# Altium schematic sheet Sheet1.SchDoc
size A3; SheetNumber: 1; SheetTotal: 1; Project: IGBT Gate Driver 15A
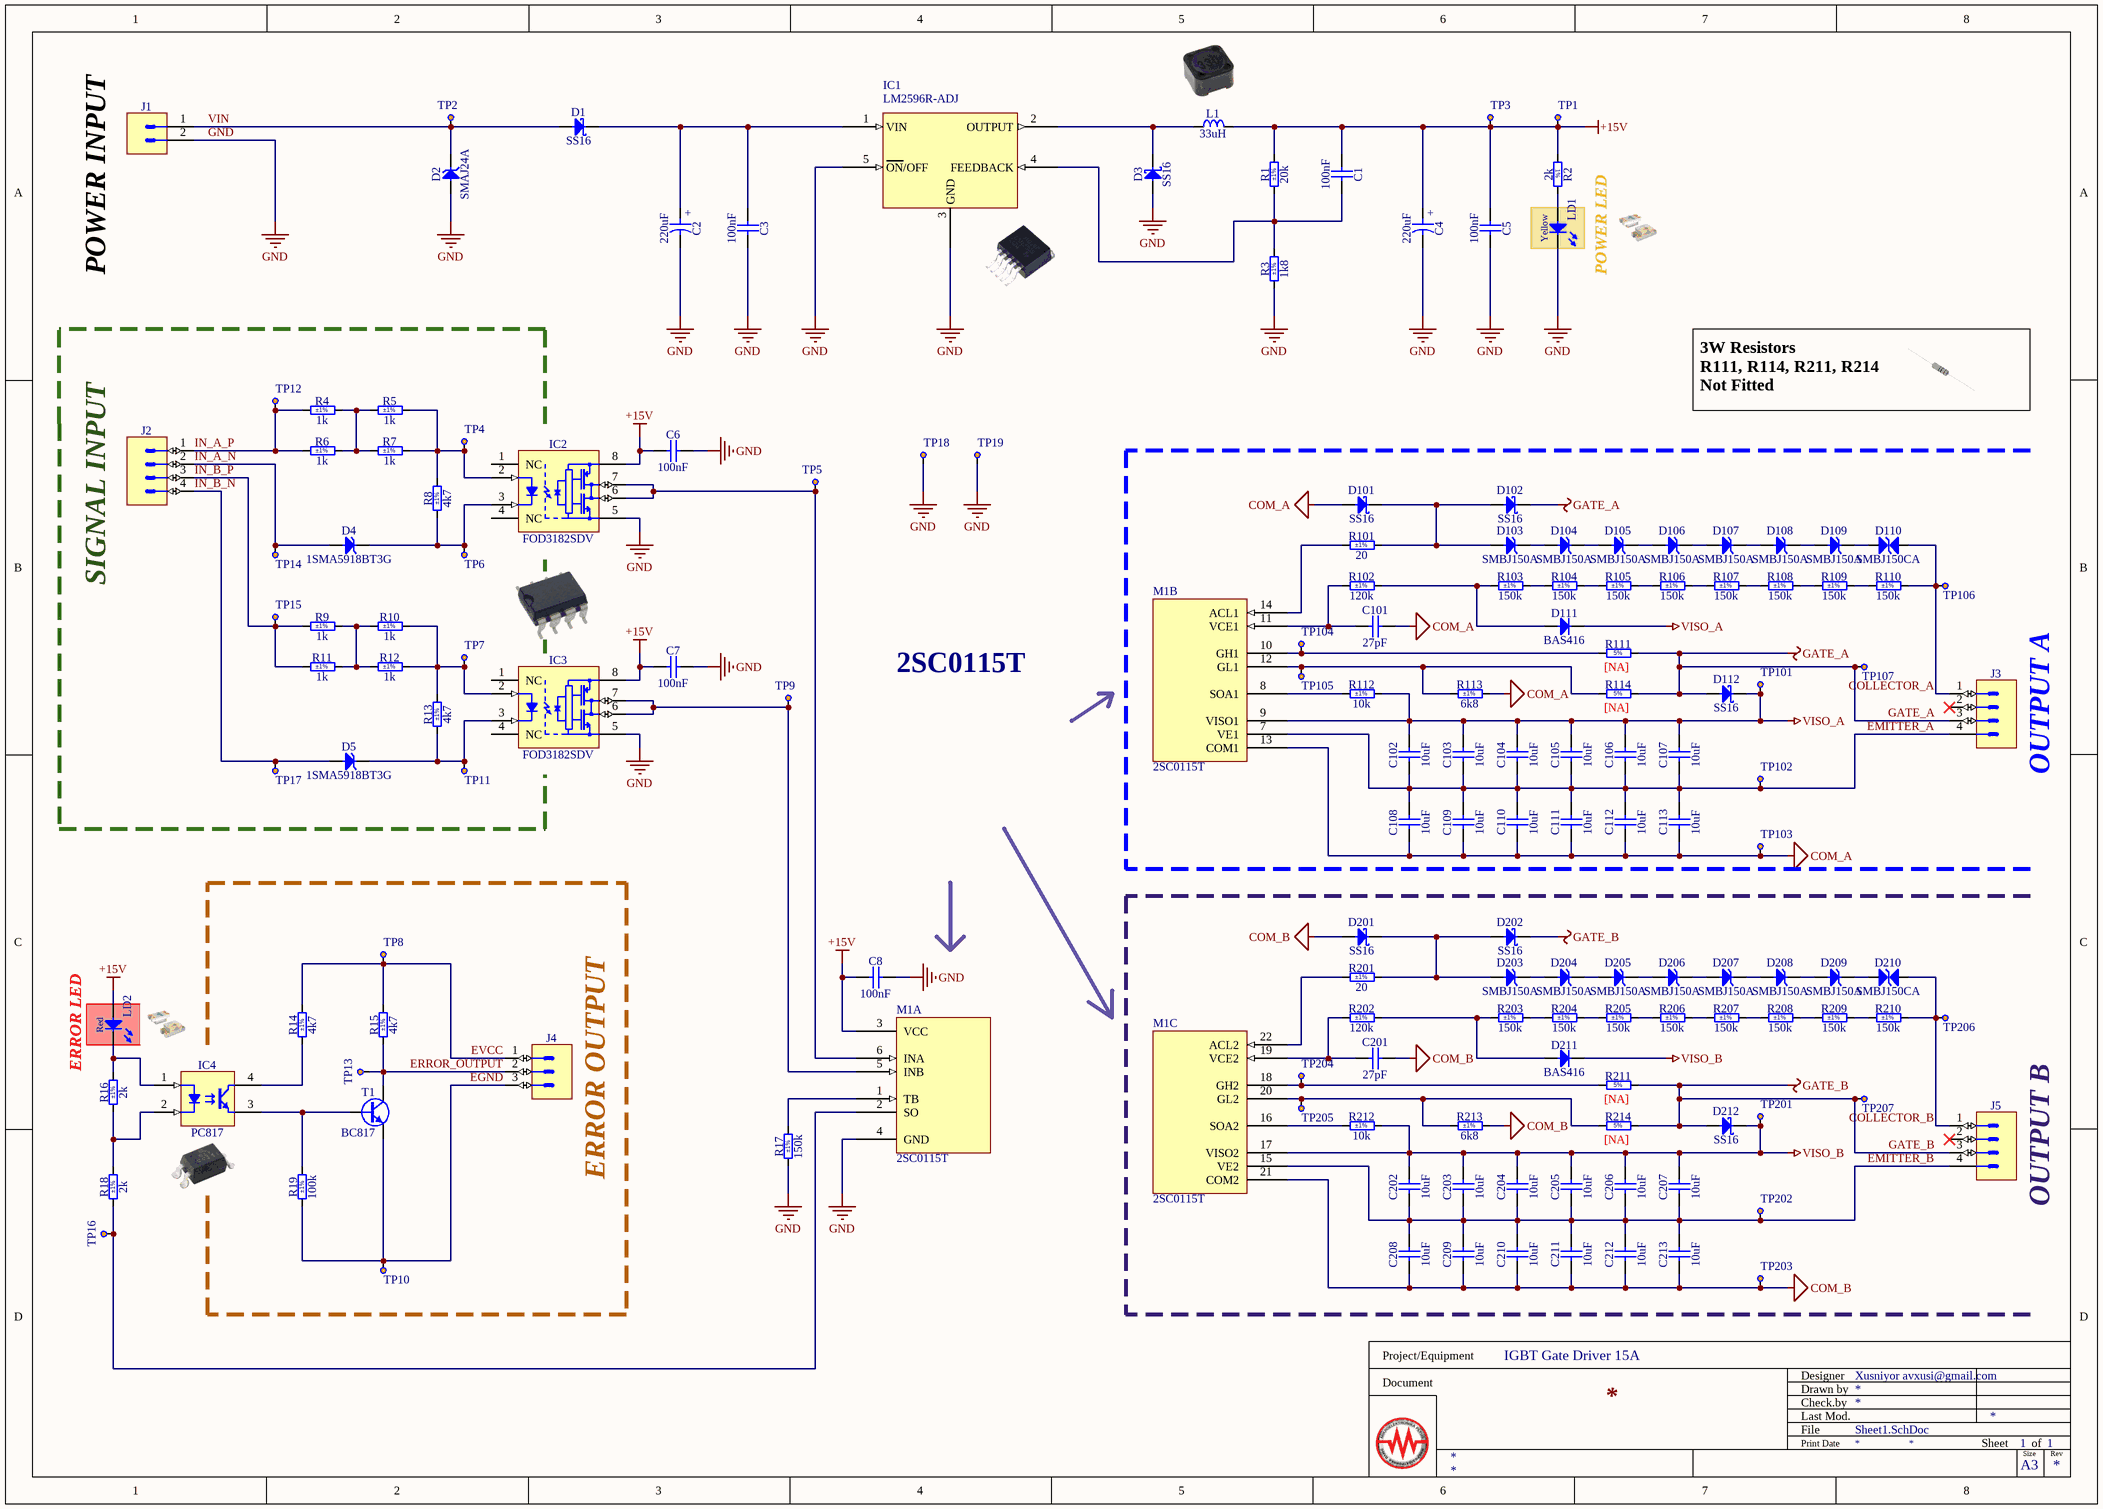
[diagram p0: Sheet1.SchDoc]

## Parts
C1  100nF  [CAPC3216X140N]
C2  220uF  [CAPPR500-1050X1750]
C3  100nF  [CAPC3216X140N]
C4  220uF  [CAPPR500-1050X1750]
C5  100nF  [CAPC3216X140N]
C6  100nF  [CAPC3216X140N]
C7  100nF  [CAPC3216X140N]
C8  100nF  [CAPC3216X140N]
C101  27pF  [CAPC3216X140N]
C102  10uF  [CAPC3216X180N]
C103  10uF  [CAPC3216X180N]
C104  10uF  [CAPC3216X180N]
C105  10uF  [CAPC3216X180N]
C106  10uF  [CAPC3216X180N]
C107  10uF  [CAPC3216X180N]
C108  10uF  [CAPC3216X180N]
C109  10uF  [CAPC3216X180N]
C110  10uF  [CAPC3216X180N]
C111  10uF  [CAPC3216X180N]
C112  10uF  [CAPC3216X180N]
C113  10uF  [CAPC3216X180N]
C201  27pF  [CAPC3216X140N]
C202  10uF  [CAPC3216X180N]
C203  10uF  [CAPC3216X180N]
C204  10uF  [CAPC3216X180N]
C205  10uF  [CAPC3216X180N]
C206  10uF  [CAPC3216X180N]
C207  10uF  [CAPC3216X180N]
C208  10uF  [CAPC3216X180N]
C209  10uF  [CAPC3216X180N]
C210  10uF  [CAPC3216X180N]
C211  10uF  [CAPC3216X180N]
C212  10uF  [CAPC3216X180N]
C213  10uF  [CAPC3216X180N]
D1  SS16  [DIOM5127X229N]
D2  SMAJ24A  [DIOM5226X262N]
D3  SS16  [DIOM5127X229N]
D4  1SMA5918BT3G  [DIOM5226X220N]
D5  1SMA5918BT3G  [DIOM5226X220N]
D101  SS16  [DIOM5127X229N]
D102  SS16  [DIOM5127X229N]
D103  SMBJ150A  [DIOM5336X265N]
D104  SMBJ150A  [DIOM5336X265N]
D105  SMBJ150A  [DIOM5336X265N]
D106  SMBJ150A  [DIOM5336X265N]
D107  SMBJ150A  [DIOM5336X265N]
D108  SMBJ150A  [DIOM5336X265N]
D109  SMBJ150A  [DIOM5336X265N]
D110  SMBJ150CA  [DIOM5336X265N]
D111  BAS416  [SOD2512X110N]
D112  SS16  [DIOM5127X229N]
D201  SS16  [DIOM5127X229N]
D202  SS16  [DIOM5127X229N]
D203  SMBJ150A  [DIOM5336X265N]
D204  SMBJ150A  [DIOM5336X265N]
D205  SMBJ150A  [DIOM5336X265N]
D206  SMBJ150A  [DIOM5336X265N]
D207  SMBJ150A  [DIOM5336X265N]
D208  SMBJ150A  [DIOM5336X265N]
D209  SMBJ150A  [DIOM5336X265N]
D210  SMBJ150CA  [DIOM5336X265N]
D211  BAS416  [SOD2512X110N]
D212  SS16  [DIOM5127X229N]
IC1  LM2596R-ADJ  [TO-263-5]
IC2  FOD3182SDV  [FAIRCHILD_8LD MDIP (OPTION S)]
IC3  FOD3182SDV  [FAIRCHILD_8LD MDIP (OPTION S)]
IC4  PC817  [FAIRCHILD_FOD817DSD]
J1  (no value)  [PHOENIX_1777073]
J2  (no value)  [PHOENIX_1777099]
J3  (no value)  [PHOENIX_1777099]
J4  (no value)  [PHOENIX_1777086]
J5  (no value)  [PHOENIX_1777099]
L1  33uH  [IND_BOURNS_PM127SH]
LD1  Yellow  [LED_3MM_YELLOW_1C-2A]
LD2  Red  [LED_3MM_RED_1C-2A]
M1  2SC0115T  [2sc0115t]  (parts A,B,C of 3)
R1  20k  Tolerance: ±1%  [RESC3216X65N]
R2  2k  [RESC3216X65N]
R3  1k8  Tolerance: ±1%  [RESC3216X65N]
R4  1k  Tolerance: ±1%  [RESC3216X65N]
R5  1k  Tolerance: ±1%  [RESC3216X65N]
R6  1k  Tolerance: ±1%  [RESC3216X65N]
R7  1k  Tolerance: ±1%  [RESC3216X65N]
R8  4k7  Tolerance: ±1%  [RESC3216X65N]
R9  1k  Tolerance: ±1%  [RESC3216X65N]
R10  1k  Tolerance: ±1%  [RESC3216X65N]
R11  1k  Tolerance: ±1%  [RESC3216X65N]
R12  1k  Tolerance: ±1%  [RESC3216X65N]
R13  4k7  Tolerance: ±1%  [RESC3216X65N]
R14  4k7  Tolerance: ±1%  [RESC3216X65N]
R15  4k7  Tolerance: ±1%  [RESC3216X65N]
R16  2k  Tolerance: ±1%  [RESC3216X70N]
R17  150k  Tolerance: ±1%  [RESC3216X65N]
R18  2k  Tolerance: ±1%  [RESC3216X70N]
R19  100k  Tolerance: ±1%  [RESC3216X65N]
R101  20  Tolerance: ±1%  [RESC3216X65N]
R102  120k  Tolerance: ±1%  [RESC3216X65N]
R103  150k  Tolerance: ±1%  [RESC3216X65N]
R104  150k  Tolerance: ±1%  [RESC3216X65N]
R105  150k  Tolerance: ±1%  [RESC3216X65N]
R106  150k  Tolerance: ±1%  [RESC3216X65N]
R107  150k  Tolerance: ±1%  [RESC3216X65N]
R108  150k  Tolerance: ±1%  [RESC3216X65N]
R109  150k  Tolerance: ±1%  [RESC3216X65N]
R110  150k  Tolerance: ±1%  [RESC3216X65N]
R111  5R6  [RES2286-1670X520]  (value not drawn)
R112  10k  Tolerance: ±1%  [RESC3216X65N]
R113  6k8  Tolerance: ±1%  [RESC3216X65N]
R114  5R6  [RES2286-1670X520]  (value not drawn)
R201  20  Tolerance: ±1%  [RESC3216X65N]
R202  120k  Tolerance: ±1%  [RESC3216X65N]
R203  150k  Tolerance: ±1%  [RESC3216X65N]
R204  150k  Tolerance: ±1%  [RESC3216X65N]
R205  150k  Tolerance: ±1%  [RESC3216X65N]
R206  150k  Tolerance: ±1%  [RESC3216X65N]
R207  150k  Tolerance: ±1%  [RESC3216X65N]
R208  150k  Tolerance: ±1%  [RESC3216X65N]
R209  150k  Tolerance: ±1%  [RESC3216X65N]
R210  150k  Tolerance: ±1%  [RESC3216X65N]
R211  5R6  [RES2286-1670X520]  (value not drawn)
R212  10k  Tolerance: ±1%  [RESC3216X65N]
R213  6k8  Tolerance: ±1%  [RESC3216X65N]
R214  5R6  [RES2286-1670X520]  (value not drawn)
T1  BC817  [SOT95P230X110-3N]
TP1  Test_point  [TP_C40]  (value not drawn)
TP2  Test_point  [TP_C40]  (value not drawn)
TP3  Test_point  [TP_C40]  (value not drawn)
TP4  Test_point  [TP_C40]  (value not drawn)
TP5  Test_point  [TP_C40]  (value not drawn)
TP6  Test_point  [TP_C40]  (value not drawn)
TP7  Test_point  [TP_C40]  (value not drawn)
TP8  Test_point  [TP_C40]  (value not drawn)
TP9  Test_point  [TP_C40]  (value not drawn)
TP10  Test_point  [TP_C40]  (value not drawn)
TP11  Test_point  [TP_C40]  (value not drawn)
TP12  Test_point  [TP_C40]  (value not drawn)
TP13  Test_point  [TP_C40]  (value not drawn)
TP14  Test_point  [TP_C40]  (value not drawn)
TP15  Test_point  [TP_C40]  (value not drawn)
TP16  Test_point  [TP_C40]  (value not drawn)
TP17  Test_point  [TP_C40]  (value not drawn)
TP18  Test_point  [TP_C40]  (value not drawn)
TP19  Test_point  [TP_C40]  (value not drawn)
TP101  Test_point  [TP_C40]  (value not drawn)
TP102  Test_point  [TP_C40]  (value not drawn)
TP103  Test_point  [TP_C40]  (value not drawn)
TP104  Test_point  [TP_C40]  (value not drawn)
TP105  Test_point  [TP_C40]  (value not drawn)
TP106  Test_point  [TP_C40]  (value not drawn)
TP107  Test_point  [TP_C40]  (value not drawn)
TP201  Test_point  [TP_C40]  (value not drawn)
TP202  Test_point  [TP_C40]  (value not drawn)
TP203  Test_point  [TP_C40]  (value not drawn)
TP204  Test_point  [TP_C40]  (value not drawn)
TP205  Test_point  [TP_C40]  (value not drawn)
TP206  Test_point  [TP_C40]  (value not drawn)
TP207  Test_point  [TP_C40]  (value not drawn)

## Nets
+15V: C1.1 C4.1 C5.1 C6.1 C7.1 C8.1 IC2.8(VDD) IC3.8(VDD) L1.2 LD2.2(A) M1.3(VCC) R1.2 R2.1 TP1.1 TP3.1
COM_A: C101.2 C108.1 C109.1 C110.1 C111.1 C112.1 C113.1 D101.2(A) M1.13(COM1) R113.2 TP103.1
COM_B: C201.2 C208.1 C209.1 C210.1 C211.1 C212.1 C213.1 D201.2(A) M1.21(COM2) R213.2 TP203.1
GATE_A: D102.1(C) D112.2(A) J3.3 R111.2 R114.2 TP107.1
GATE_B: D202.1(C) D212.2(A) J5.3 R211.2 R214.2 TP207.1
GND: C2.2 C3.2 C4.2 C5.2 C6.2 C7.2 C8.2 D2.2(A) D3.2(A) IC1.3(GND) IC1.5(ON/OFF) IC2.5(VSS) IC3.5(VSS) J1.2 LD1.1(C) M1.4(GND) R3.1 R17.1 TP18.1 TP19.1
VISO_A: C102.2 C103.2 C104.2 C105.2 C106.2 C107.2 D111.1(C) D112.1(C) M1.9(VISO1) R112.2 TP101.1
VISO_B: C202.2 C203.2 C204.2 C205.2 C206.2 C207.2 D211.1(C) D212.1(C) M1.17(VISO2) R212.2 TP201.1
COLLECTOR_A: D110.2 J3.1 R110.2 TP106.1
COLLECTOR_B: D210.2 J5.1 R210.2 TP206.1
EGND: J4.3 R19.1 T1.2(E) TP10.1
EMITTER_A: C102.1 C103.1 C104.1 C105.1 C106.1 C107.1 C108.2 C109.2 C110.2 C111.2 C112.2 C113.2 J3.4 M1.7(VE1) TP102.1
EMITTER_B: C202.1 C203.1 C204.1 C205.1 C206.1 C207.1 C208.2 C209.2 C210.2 C211.2 C212.2 C213.2 J5.4 M1.15(VE2) TP202.1
ERROR_OUTPUT: J4.2 R15.1 T1.3(C) TP13.1
EVCC: J4.1 R14.2 R15.2 TP8.1
IN_A_N: D4.2(A) J2.2 TP14.1
IN_A_P: J2.1 R4.1 R6.1 TP12.1
IN_B_N: D5.2(A) J2.4 TP17.1
IN_B_P: J2.3 R9.1 R11.1 TP15.1
VIN: D1.2(A) D2.1(C) J1.1 TP2.1
NetC1_2: C1.2 IC1.4(FEEDBACK) R1.1 R3.2
NetC2_1: C2.1 C3.1 D1.1(C) IC1.1(VIN)
NetC101_1: C101.1 M1.11(VCE1) R102.1
NetC201_1: C201.1 M1.19(VCE2) R202.1
NetD3_1: D3.1(C) IC1.2(OUTPUT) L1.1
NetD4_1: D4.1(C) IC2.3(K) R8.1 TP6.1
NetD5_1: D5.1(C) IC3.3(K) R13.1 TP11.1
NetD101_1: D101.1(C) D102.2(A) D103.2(A) R101.2
NetD103_1: D103.1(C) D104.2(A)
NetD104_1: D104.1(C) D105.2(A)
NetD105_1: D105.1(C) D106.2(A)
NetD106_1: D106.1(C) D107.2(A)
NetD107_1: D107.1(C) D108.2(A)
NetD108_1: D108.1(C) D109.2(A)
NetD109_1: D109.1(C) D110.1
NetD111_2: D111.2(A) R102.2 R103.1
NetD201_1: D201.1(C) D202.2(A) D203.2(A) R201.2
NetD203_1: D203.1(C) D204.2(A)
NetD204_1: D204.1(C) D205.2(A)
NetD205_1: D205.1(C) D206.2(A)
NetD206_1: D206.1(C) D207.2(A)
NetD207_1: D207.1(C) D208.2(A)
NetD208_1: D208.1(C) D209.2(A)
NetD209_1: D209.1(C) D210.1
NetD211_2: D211.2(A) R202.2 R203.1
NetIC2_2: IC2.2(A) R5.2 R7.2 R8.2 TP4.1
NetIC2_6: IC2.6(VO1) IC2.7(VO2) M1.6(INA) TP5.1
NetIC3_2: IC3.2(A) R10.2 R12.2 R13.2 TP7.1
NetIC3_6: IC3.6(VO1) IC3.7(VO2) M1.5(INB) TP9.1
NetIC4_1: IC4.1(A) LD2.1(C) R16.2
NetIC4_2: IC4.2(C) R16.1 R18.2
NetIC4_3: IC4.3(E) R19.2 T1.1(B)
NetIC4_4: IC4.4(C) R14.1
NetLD1_2: LD1.2(A) R2.2
NetM1_1: M1.1(TB) R17.2
NetM1_2: M1.2(SO) R18.1 TP16.1
NetM1_8: M1.8(SOA1) R112.1
NetM1_10: M1.10(GH1) R111.1 TP104.1
NetM1_12: M1.12(GL1) R113.1 R114.1 TP105.1
NetM1_14: M1.14(ACL1) R101.1
NetM1_16: M1.16(SOA2) R212.1
NetM1_18: M1.18(GH2) R211.1 TP204.1
NetM1_20: M1.20(GL2) R213.1 R214.1 TP205.1
NetM1_22: M1.22(ACL2) R201.1
NetR4_2: R4.2 R5.1 R6.2 R7.1
NetR9_2: R9.2 R10.1 R11.2 R12.1
NetR103_2: R103.2 R104.1
NetR104_2: R104.2 R105.1
NetR105_2: R105.2 R106.1
NetR106_2: R106.2 R107.1
NetR107_2: R107.2 R108.1
NetR108_2: R108.2 R109.1
NetR109_2: R109.2 R110.1
NetR203_2: R203.2 R204.1
NetR204_2: R204.2 R205.1
NetR205_2: R205.2 R206.1
NetR206_2: R206.2 R207.1
NetR207_2: R207.2 R208.1
NetR208_2: R208.2 R209.1
NetR209_2: R209.2 R210.1

Not connected (* = marked no-connect by the designer): IC2 1(NC) 4(NC); IC3 1(NC) 4(NC); J3 2*; J5 2*

## Notes on the sheet
- POWER INPUT
- POWER LED
- 3W Resistors
  R111, R114, R211, R214
  Not Fitted
- SIGNAL INPUT
- 2SC0115T
- (near R111) [NA]
- (near R114) [NA]
- (near J3) OUTPUT A
- ERROR LED
- (near R211) [NA]
- (near J4) ERROR OUTPUT
- (near R214) [NA]
- (near J5) OUTPUT B
- Project/Equipment
- Document
- IGBT Gate Driver 15A
- Designer
- Drawn by
- Check.by
- Xusniyor avxusi@gmail.com
- File
- Last Mod.
- Print Date
- Sheet
- Size
- A3
- of
- Rev
- (in symbol CAER_220UF_35V_20%_500-1050X1750_LESR0R084) +
- (in symbol R1206_2K_1%_0.25W_100PPM) 1%
- (in symbol RMF_5R6_5%_3W_250PPM_2286-1670X520) 5%

## Library data of the parts
C1 C3 C5-C8 = CC1206_100NF_50V_10%_X7R: Non-polarised capacitor; Part Description: SMD Multilayer Chip Ceramic Capacitor; Manufacturer: GENERIC; Manufacturer1 Part Number: VJ1206Y104KXAAT; Voltage: 50V; TC: X7R; Tolerance: ±10%; Part Number: CC1206_100NF_50V_10%_X7R; Component Kind: Standard; Component Type: Standard; Pin Count: 2; Value: 100nF; Status: Preferred; Manufacturer Part Number: CC1206_100NF_50V_10%_X7R; Case: 1206; Mounted: Yes; Socket: No; SMD: Yes; Sense: No; Manufacturer1 Example: VISHAY VITRAMON; Manufacturer1 ComponentHeight: 1.7mm; HelpURL: \\cern.ch\dfs\Applications\Altium\Datasheets\CC1206_X7R_VISHAY_VJ.pdf; Author: CERN DEM JLC; CreateDate: 03.12.2007; LatestRevisionDate: 03.12.2007
C2 C4 = CAER_220UF_35V_20%_500-1050X1750_LESR0R084: Polarised capacitor; Part Description: Low ESR 0R084  Aluminum Electrolytic Capacitor; Manufacturer: VISHAY BCCOMPONENTS; Manufacturer Part Number: MAL213660221E3 Series 136RVI; Voltage: 35V; Tolerance: ±20%; Part Number: CAER_220UF_35V_20%_500-1050X1750_LESR0R084; Component Kind: Standard; Component Type: Standard; Pin Count: 2; Value: 220uF; Status: Preferred; Case: LS5 D10.5 x H17.5; Mounted: Yes; Socket: No; SMD: No; Sense: No; ComponentHeight: 17.5mm; HelpURL: \\cern.ch\dfs\Applications\Altium\Datasheets\CAER-LESR_VISHAY_136RVI.pdf; Author: CERN DEM JLC; CreateDate: 03.07.2008; LatestRevisionDate: 16.03.2009
C101 C201 = CC1206_27PF_50V_5%_NP0: Non-polarised capacitor; Part Description: SMD Multilayer Chip Ceramic Capacitor; Manufacturer: GENERIC; Manufacturer1 Part Number: VJ1206A270JXAAT; Voltage: 50V; TC: C0G/NP0; Tolerance: ±5%; Part Number: CC1206_27PF_50V_5%_NP0; Component Kind: Standard; Component Type: Standard; Pin Count: 2; Value: 27pF; Status: Preferred; Manufacturer Part Number: CC1206_27PF_50V_5%_NP0; Case: 1206; Mounted: Yes; Socket: No; SMD: Yes; Sense: No; Manufacturer1 Example: VISHAY VITRAMON; Manufacturer1 ComponentHeight: 1.7mm; HelpURL: \\cern.ch\dfs\Applications\Altium\Datasheets\CC1206_NP0_VISHAY_VJ.pdf; Author: CERN DEM JLC; CreateDate: 03.12.2007; LatestRevisionDate: 03.12.2007
C102-C113 C202-C213 = CC1206_10UF_25V_10%_X7R: Non-polarised capacitor; Part Description: SMD Multilayer Chip Ceramic Capacitor; Manufacturer: GENERIC; Manufacturer1 Part Number: C1206C106K4RACTU; Voltage: 25V; TC: X7R; Tolerance: ±10%; Part Number: CC1206_10UF_25V_10%_X7R; Component Kind: Standard; Component Type: Standard; Pin Count: 2; Value: 10uF; Status: Preferred; Manufacturer Part Number: CC1206_10UF_25V_10%_X7R; Case: 1206; Mounted: Yes; Socket: No; SMD: Yes; Sense: No; Manufacturer1 Example: KEMET; Manufacturer1 ComponentHeight: 1.8mm; HelpURL: \\cern.ch\dfs\Applications\Altium\Datasheets\CC1206_X7R_KEMET.pdf; Author: CERN DEM JLC; CreateDate: 12.09.2012; LatestRevisionDate: 12.09.2012
D1 D3 D101 D102 D112 D201 D202 D212 = SS16: Schottky Diode; Part Description: Surface Mount Schottky Barrier Rectifier; Manufacturer: VISHAY GENERAL SEMICONDUCTOR; Voltage: 60V; Power: 1A; PressFit: No; Bonding: No; Part Number: SS16; Component Kind: Standard; Component Type: Standard; Device: SS16; PackageDescription: DO-214-AC Molded Diode, Body 5.1x2.7mm, IPC Medium Density; Manufacturer Part Number: SS16; Pin Count: 2; Case: DO-214AC; Mounted: Yes; Socket: No; SMD: Yes; Sense: No; ComponentHeight: 2.29mm; HelpURL: \\cern.ch\dfs\Applications\Altium\Datasheets\SS16.pdf; Author: CERN DEM JLC; CreateDate: 15.07.2008; LatestRevisionDate: 23.08.2010
D2 = SMAJ24A: Transient Voltage Suppressor Diode (Uni-Directional); Part Description: Surface Mount Uni-directional Transient Voltage Suppressor Diode; Manufacturer: BOURNS; Voltage: 24V; Power: 400W; PressFit: No; Bonding: No; Part Number: SMAJ24A; Component Kind: Standard; Component Type: Standard; Device: SMAJ24A; PackageDescription: DO-214-AC/SMA Diode, Molded Body; 5.21mm L X 2.605mm W X 2.62mm H, IPC Medium Density; Manufacturer Part Number: SMAJ24A; Pin Count: 2; Case: DO-214AC; Mounted: Yes; Socket: No; SMD: Yes; Sense: No; ComponentHeight: 2.62mm; HelpURL: \\cern.ch\dfs\Applications\Altium\Datasheets\SMAJ24A.pdf; Author: CERN DEM JLC; CreateDate: 27.06.2011; LatestRevisionDate: 27.06.2011
D4 D5 = 1SMA5918BT3G: Zener Diode; Part Description: Zener Voltage Regulators; Manufacturer: ON SEMICONDUCTOR; Voltage: 5.1V; Power: 1.5W; PressFit: No; Bonding: No; Part Number: 1SMA5918BT3G; Component Kind: Standard; Component Type: Standard; Device: 1SMA5918BT3G; PackageDescription: DO-214-AC/SMA Diode, Molded Body; 5.21mm L X 2.60mm W X 2.20mm H, IPC Medium Density; Manufacturer Part Number: 1SMA5918BT3G; Pin Count: 2; Case: DO-214AC; Mounted: Yes; Socket: No; SMD: Yes; Sense: No; ComponentHeight: 2.20mm; HelpURL: \\cern.ch\dfs\Applications\Altium\Datasheets\1SMA5918BT3G.pdf; Author: CERN DEM JLC; CreateDate: 16.02.2012; LatestRevisionDate: 16.02.2012
D103-D109 D203-D209 = SMBJ150A: Transient Voltage Suppressor Diode (Uni-Directional); Part Description: Uni-Directional Transient Voltage Suppressor Diode; Manufacturer: FAIRCHILD SEMICONDUCTOR; Voltage: 150V; Power: 600W; PressFit: No; Bonding: No; Part Number: SMBJ150A; Component Kind: Standard; Component Type: Standard; Device: SMBJ150A; PackageDescription: DO-214-AA/SMB Diode, Molded Body; 5.34mm L X 3.625mm W X 2.65mm H, IPC Medium Density; Manufacturer Part Number: SMBJ150A; Pin Count: 2; Case: DO-214AA; Mounted: Yes; Socket: No; SMD: Yes; Sense: No; ComponentHeight: 2.65mm; HelpURL: \\cern.ch\dfs\Applications\Altium\Datasheets\SMBJ.pdf; Author: CERN DEM MR; CreateDate: 14.01.2016; LatestRevisionDate: 14.01.2016
D110 D210 = SMBJ150CA: Transient Voltage Suppressor Diode (Bi-Directional); Part Description: Bi-Directional Transient Voltage Suppressor Diode; Manufacturer: FAIRCHILD SEMICONDUCTOR; Voltage: 150V; Power: 600W; PressFit: No; Bonding: No; Part Number: SMBJ150CA; Component Kind: Standard; Component Type: Standard; Device: SMBJ150CA; PackageDescription: DO-214-AA/SMB Diode, Molded Body; 5.34mm L X 3.625mm W X 2.65mm H, IPC Medium Density; Manufacturer Part Number: SMBJ150CA; Pin Count: 2; Case: DO-214AA; Mounted: Yes; Socket: No; SMD: Yes; Sense: No; ComponentHeight: 2.65mm; HelpURL: \\cern.ch\dfs\Applications\Altium\Datasheets\SMBJ.pdf; Author: CERN DEM BC; CreateDate: 24.03.2020; LatestRevisionDate: 24.03.2020
D111 D211 = BAS416: Diode; Part Description: Low-Leakage Diode; Manufacturer: NXP SEMICONDUCTORS; Voltage: 75V; Power: 200mA; PressFit: No; Bonding: No; Part Number: BAS416; Component Kind: Standard; Component Type: Standard; Device: BAS416; PackageDescription: Small Outline Diode (SOD-323), 1.70mm W X 1.25mm L X 1.10mm H body,  IPC Medium Density; Manufacturer Part Number: BAS416; Pin Count: 2; Case: SOD-323; Mounted: Yes; Socket: No; SMD: Yes; Sense: No; ComponentHeight: 1.1mm; HelpURL: \\cern.ch\dfs\Applications\Altium\Datasheets\BAS416.pdf; Author: CERN DEM JLC; CreateDate: 01.10.2013; LatestRevisionDate: 01.10.2013
IC1 = LM2596: 40V 3A TO-263-5 DC-DC Converters RoHS; Manufacturer: HTC Korea TAEJIN Tech; Brand Category: International Brands; Function: Step-Down; Output Configuration: Positive or Negative; Topology: Buck; Output Type: Adjustable (Fixed); Number of Outputs: 1; Voltage - Output (Min/Fixed): 1.2V; Voltage - Output (Max): 37V; Frequency - Switching: 150kHz; Synchronous Rectifier: No; Category: Power Management ICs/DC-DC Converters; Package: TO-263-5; ComponentLink1Description: lcsc.com; ComponentLink1URL: https://lcsc.com/product-detail/DC-DC-Converters_HTC_LM2596R-ADJ_LM2596R-ADJ_C52684.html; ComponentLink2Description: Datasheet; ComponentLink2URL: https://datasheet.lcsc.com/szlcsc/HTC-Korea-TAEJIN-Tech-LM2596R-ADJ_C52684.pdf; Voltage - Input (Min): -; Voltage - Input (Max): 40V; Current - Output: 3A
IC2 IC3 = FOD3182SDV: Optocoupler; Part Description: 3A Output Current, High Speed MOSFET Gate Driver Optocoupler; Manufacturer: FAIRCHILD SEMICONDUCTOR; PressFit: No; Bonding: No; Part Number: FOD3182SDV; Component Kind: Standard; Component Type: Standard; Device: FOD3182SDV; PackageDescription: DIP Gull Wing Surface Mount, 2.54mm Pitch; 8 Pin, 9.65mm W X 6.60mm L X 5.08mm H body, FAIRCHILD 8LD MDIP; Manufacturer Part Number: FOD3182SDV; Pin Count: 8; Case: DIP8 SMD; Mounted: Yes; Socket: No; SMD: Yes; Sense: No; ComponentHeight: 5.08mm; HelpURL: \\cern.ch\dfs\Applications\Altium\Datasheets\FOD3182SDV.pdf; Author: CERN DEM JLC; CreateDate: 20.10.2014; LatestRevisionDate: 20.10.2014
IC4 = FOD817DSD: Single Optocoupler; Part Description: 4-Pin High Operating Temperature Phototransistor Optocoupler; Manufacturer: FAIRCHILD SEMICONDUCTOR; PressFit: No; Bonding: No; Part Number: FOD817DSD; Component Kind: Standard; Component Type: Standard; Device: FOD817DSD; PackageDescription: SOIC, 2.54mm Pitch; 4 Pin, 6.50mm W X 4.60mm L X 4.60mm H body; Manufacturer Part Number: FOD817DSD; Pin Count: 4; Case: SOIC4; Mounted: Yes; Socket: No; SMD: Yes; Sense: No; ComponentHeight: 4.6mm; HelpURL: \\cern.ch\dfs\Applications\Altium\Datasheets\FOD817DSD.pdf; Author: CERN DEM JLC; CreateDate: 21.07.2014; LatestRevisionDate: 21.07.2014
J1 = PHOENIX_1777073: Connector 2 Male; Part Description: 12A, 320V, Pitch 5.08mm, 2 Positions Header; Manufacturer: PHOENIX CONTACT; Manufacturer Part Number: 1777073 (MSTBV 2,5/ 2-GF-5,08); PressFit: No; Part Number: PHOENIX_1777073; Component Kind: Standard; Component Type: Standard; Pin Count: 2; Mounted: Yes; Socket: No; SMD: No; Sense: No; Status: None; ComponentHeight: 12mm; HelpURL: \\cern.ch\dfs\Applications\Altium\Datasheets\PHOENIX_1777073.pdf; Author: CERN DEM BC; CreateDate: 24.08.2015; LatestRevisionDate: 24.08.2015
J2 J3 = PHOENIX_1777099: Connector 4 Male; Part Description: 12A, 320V, Pitch 5.08mm, 4 Positions Header; Manufacturer: PHOENIX CONTACT; Manufacturer Part Number: 1777099 (MSTBV 2,5/ 4-GF-5,08); PressFit: No; Part Number: PHOENIX_1777099; Component Kind: Standard; Component Type: Standard; Pin Count: 4; Mounted: Yes; Socket: No; SMD: No; Sense: No; Status: None; ComponentHeight: 12mm; HelpURL: \\cern.ch\dfs\Applications\Altium\Datasheets\PHOENIX_1777099.pdf; Author: CERN DEM JMW; CreateDate: 20.06.2011; LatestRevisionDate: 20.06.2011
J4 = PHOENIX_1777086: Connector 3 Male; Part Description: 12A, 320V, Pitch 5.08mm, 3 Positions Header; Manufacturer: PHOENIX CONTACT; Manufacturer Part Number: 1777086 (MSTBV 2,5/ 3-GF-5,08); PressFit: No; Part Number: PHOENIX_1777086; Component Kind: Standard; Component Type: Standard; Pin Count: 3; Mounted: Yes; Socket: No; SMD: No; Sense: No; Status: None; ComponentHeight: 12mm; HelpURL: \\cern.ch\dfs\Applications\Altium\Datasheets\PHOENIX_1777086.pdf; Author: CERN DEM JMW; CreateDate: 20.06.2011; LatestRevisionDate: 20.06.2011
J5 = PHOENIX_1777099: Connector 4 Male; pin to pad: 1>4 2>3 3>2 4>1; Part Description: 12A, 320V, Pitch 5.08mm, 4 Positions Header; Manufacturer: PHOENIX CONTACT; Manufacturer Part Number: 1777099 (MSTBV 2,5/ 4-GF-5,08); PressFit: No; Part Number: PHOENIX_1777099; Component Kind: Standard; Component Type: Standard; Pin Count: 4; Mounted: Yes; Socket: No; SMD: No; Sense: No; Status: None; ComponentHeight: 12mm; HelpURL: \\cern.ch\dfs\Applications\Altium\Datasheets\PHOENIX_1777099.pdf; Author: CERN DEM JMW; CreateDate: 20.06.2011; LatestRevisionDate: 20.06.2011
L1 = IND_33UH_20%_BOURNS_PM127SH: Inductor; Part Description: Shielded SMD Power Inductor PM127SH Series; Manufacturer: BOURNS; Manufacturer Part Number: PM127SH-330M-RC; Power: 3.5A; Resistance: 0.057R; Tolerance: ±20%; Part Number: IND_33UH_20%_BOURNS_PM127SH; Component Kind: Standard; Component Type: Standard; Pin Count: 2; Value: 33uH; Status: None; Mounted: Yes; Socket: No; SMD: Yes; Sense: No; ComponentHeight: 8mm; HelpURL: \\cern.ch\dfs\Applications\Altium\Datasheets\IND_BOURNS_PM127SH.pdf; Author: CERN DEM JLC; CreateDate: 18.11.2009; LatestRevisionDate: 18.11.2009
LD1 = LED_AVAGO_HLMP-1719: LED Yellow 1C 2A; Part Description: 3mm Yellow LED; Manufacturer: AVAGO TECHNOLOGIES; PressFit: No; Bonding: No; Part Number: LED_AVAGO_HLMP-1719; Component Kind: Standard; Component Type: Standard; Color: Yellow; PackageDescription: LED, Yellow, Body Dia. 3.43 mm, Pin spacing 2.54mm; Manufacturer Part Number: HLMP-1719; Pin Count: 2; Mounted: Yes; Socket: No; SMD: No; Sense: No; ComponentHeight: 6.35mm(min); HelpURL: \\cern.ch\dfs\Applications\Altium\Datasheets\LED_AVAGO_HLMP-1719.pdf; Author: CERN DEM JLC; CreateDate: 12.06.2008; LatestRevisionDate: 17.03.2010
LD2 = LED_AVAGO_HLMP-1700: LED Red 1C 2A; Part Description: 3mm Red LED; Manufacturer: AVAGO TECHNOLOGIES; PressFit: No; Bonding: No; Part Number: LED_AVAGO_HLMP-1700; Component Kind: Standard; Component Type: Standard; Color: Red; PackageDescription: LED, Red, Body Dia. 3.43 mm, Pin spacing 2.54mm; Manufacturer Part Number: HLMP-1700; Pin Count: 2; Mounted: Yes; Socket: No; SMD: No; Sense: No; ComponentHeight: 6.35mm(min); HelpURL: \\cern.ch\dfs\Applications\Altium\Datasheets\LED_AVAGO_HLMP-1700.pdf; Author: CERN DEM JLC; CreateDate: 12.06.2008; LatestRevisionDate: 17.03.2010
M1 = 2SC0115T: pin to pad: 5>6 6>5
R1 = R1206_20K_1%_0.25W_100PPM: Resistor - 1%; Part Description: General Purpose Thick Film Chip Resistor; Manufacturer: GENERIC; Manufacturer1 Part Number: NRC12F2002TRF; Power: 0.25W; TC: ±100ppm/°C; PressFit: No; Part Number: R1206_20K_1%_0.25W_100PPM; Component Kind: Standard; Component Type: Standard; Pin Count: 2; Value: 20k; Status: Preferred; Manufacturer Part Number: R1206_20K_1%_0.25W_100PPM; Case: 1206; Mounted: Yes; Sense: No; Socket: No; SMD: Yes; Manufacturer1 Example: NIC COMPONENT; Manufacturer1 ComponentHeight: 0.65mm; HelpURL: \\cern.ch\dfs\Applications\Altium\Datasheets\R1206_NIC_NRC.pdf; Author: CERN DEM JLC; CreateDate: 03.12.2007; LatestRevisionDate: 13.03.2008
R2 = R1206_2K_1%_0.25W_100PPM: Resistor - 1%; Part Description: General Purpose Thick Film Chip Resistor; Manufacturer: GENERIC; Manufacturer1 Part Number: NRC12F2001TRF; Power: 0.25W; TC: ±100ppm/°C; PressFit: No; Part Number: R1206_2K_1%_0.25W_100PPM; Component Kind: Standard; Component Type: Standard; Pin Count: 2; Value: 2k; Status: Preferred; Tolerance: ±1%; Manufacturer Part Number: R1206_2K_1%_0.25W_100PPM; Case: 1206; Mounted: Yes; Sense: No; Socket: No; SMD: Yes; Manufacturer1 Example: NIC COMPONENT; Manufacturer1 ComponentHeight: 0.65mm; HelpURL: \\cern.ch\dfs\Applications\Altium\Datasheets\R1206_NIC_NRC.pdf; Author: CERN DEM JLC; CreateDate: 03.12.2007; LatestRevisionDate: 13.03.2008
R3 = R1206_1K8_1%_0.25W_100PPM: Resistor - 1%; Part Description: General Purpose Thick Film Chip Resistor; Manufacturer: GENERIC; Manufacturer1 Part Number: NRC12F1801TRF; Power: 0.25W; TC: ±100ppm/°C; PressFit: No; Part Number: R1206_1K8_1%_0.25W_100PPM; Component Kind: Standard; Component Type: Standard; Pin Count: 2; Value: 1k8; Status: Preferred; Manufacturer Part Number: R1206_1K8_1%_0.25W_100PPM; Case: 1206; Mounted: Yes; Sense: No; Socket: No; SMD: Yes; Manufacturer1 Example: NIC COMPONENT; Manufacturer1 ComponentHeight: 0.65mm; HelpURL: \\cern.ch\dfs\Applications\Altium\Datasheets\R1206_NIC_NRC.pdf; Author: CERN DEM JLC; CreateDate: 03.12.2007; LatestRevisionDate: 13.03.2008
R4-R7 R9-R12 = R1206_1K_1%_0.25W_100PPM: Resistor - 1%; Part Description: General Purpose Thick Film Chip Resistor; Manufacturer: GENERIC; Manufacturer1 Part Number: NRC12F1001TRF; Power: 0.25W; TC: ±100ppm/°C; PressFit: No; Part Number: R1206_1K_1%_0.25W_100PPM; Component Kind: Standard; Component Type: Standard; Pin Count: 2; Value: 1k; Status: Preferred; Manufacturer Part Number: R1206_1K_1%_0.25W_100PPM; Case: 1206; Mounted: Yes; Sense: No; Socket: No; SMD: Yes; Manufacturer1 Example: NIC COMPONENT; Manufacturer1 ComponentHeight: 0.65mm; HelpURL: \\cern.ch\dfs\Applications\Altium\Datasheets\R1206_NIC_NRC.pdf; Author: CERN DEM JLC; CreateDate: 03.12.2007; LatestRevisionDate: 13.03.2008
R8 R13-R15 = R1206_4K7_1%_0.25W_100PPM: Resistor - 1%; Part Description: General Purpose Thick Film Chip Resistor; Manufacturer: GENERIC; Manufacturer1 Part Number: NRC12F4701TRF; Power: 0.25W; TC: ±100ppm/°C; PressFit: No; Part Number: R1206_4K7_1%_0.25W_100PPM; Component Kind: Standard; Component Type: Standard; Pin Count: 2; Value: 4k7; Status: Preferred; Manufacturer Part Number: R1206_4K7_1%_0.25W_100PPM; Case: 1206; Mounted: Yes; Sense: No; Socket: No; SMD: Yes; Manufacturer1 Example: NIC COMPONENT; Manufacturer1 ComponentHeight: 0.65mm; HelpURL: \\cern.ch\dfs\Applications\Altium\Datasheets\R1206_NIC_NRC.pdf; Author: CERN DEM JLC; CreateDate: 03.12.2007; LatestRevisionDate: 13.03.2008
R16 R18 = R1206_2K_1%_0.33W_200PPM_KOA_SG73S2BTTD2001F: Resistor - 1%; Part Description: Surge Current Thick Film Chip Resistor; Manufacturer: KOA; Power: 0.33W; TC: ±200ppm/°C; PressFit: No; Part Number: R1206_2K_1%_0.33W_200PPM_KOA_SG73S2BTTD2001F; Component Kind: Standard; Component Type: Standard; Pin Count: 2; Value: 2k; Status: Not Recommended; Manufacturer Part Number: SG73S2BTTD2001F; Case: 1206; Mounted: Yes; Sense: No; Socket: No; SMD: Yes; ComponentHeight: 0.7mm; HelpURL: \\cern.ch\dfs\Applications\Altium\Datasheets\R1206_KOA_SG73.pdf; Author: CERN DEM JMW; CreateDate: 20.08.2009; LatestRevisionDate: 20.08.2009
R17 R103-R110 R203-R210 = R1206_150K_1%_0.25W_100PPM: Resistor - 1%; Part Description: General Purpose Thick Film Chip Resistor; Manufacturer: GENERIC; Manufacturer1 Part Number: NRC12F1503TRF; Power: 0.25W; TC: ±100ppm/°C; PressFit: No; Part Number: R1206_150K_1%_0.25W_100PPM; Component Kind: Standard; Component Type: Standard; Pin Count: 2; Value: 150k; Status: Preferred; Manufacturer Part Number: R1206_150K_1%_0.25W_100PPM; Case: 1206; Mounted: Yes; Sense: No; Socket: No; SMD: Yes; Manufacturer1 Example: NIC COMPONENT; Manufacturer1 ComponentHeight: 0.65mm; HelpURL: \\cern.ch\dfs\Applications\Altium\Datasheets\R1206_NIC_NRC.pdf; Author: CERN DEM JLC; CreateDate: 03.12.2007; LatestRevisionDate: 13.03.2008
R19 = R1206_100K_1%_0.25W_100PPM: Resistor - 1%; Part Description: General Purpose Thick Film Chip Resistor; Manufacturer: GENERIC; Manufacturer1 Part Number: NRC12F1003TRF; Power: 0.25W; TC: ±100ppm/°C; PressFit: No; Part Number: R1206_100K_1%_0.25W_100PPM; Component Kind: Standard; Component Type: Standard; Pin Count: 2; Value: 100k; Status: Preferred; Manufacturer Part Number: R1206_100K_1%_0.25W_100PPM; Case: 1206; Mounted: Yes; Sense: No; Socket: No; SMD: Yes; Manufacturer1 Example: NIC COMPONENT; Manufacturer1 ComponentHeight: 0.65mm; HelpURL: \\cern.ch\dfs\Applications\Altium\Datasheets\R1206_NIC_NRC.pdf; Author: CERN DEM JLC; CreateDate: 03.12.2007; LatestRevisionDate: 13.03.2008
R101 R201 = R1206_20R_1%_0.25W_100PPM: Resistor - 1%; Part Description: General Purpose Thick Film Chip Resistor; Manufacturer: GENERIC; Manufacturer1 Part Number: NRC12F20R0TRF; Power: 0.25W; TC: ±100ppm/°C; PressFit: No; Part Number: R1206_20R_1%_0.25W_100PPM; Component Kind: Standard; Component Type: Standard; Pin Count: 2; Value: 20; Status: Preferred; Manufacturer Part Number: R1206_20R_1%_0.25W_100PPM; Case: 1206; Mounted: Yes; Sense: No; Socket: No; SMD: Yes; Manufacturer1 Example: NIC COMPONENT; Manufacturer1 ComponentHeight: 0.65mm; HelpURL: \\cern.ch\dfs\Applications\Altium\Datasheets\R1206_NIC_NRC.pdf; Author: CERN DEM JLC; CreateDate: 03.12.2007; LatestRevisionDate: 13.03.2008
R102 R202 = R1206_120K_1%_0.25W_100PPM: Resistor - 1%; Part Description: General Purpose Thick Film Chip Resistor; Manufacturer: GENERIC; Manufacturer1 Part Number: NRC12F1203TRF; Power: 0.25W; TC: ±100ppm/°C; PressFit: No; Part Number: R1206_120K_1%_0.25W_100PPM; Component Kind: Standard; Component Type: Standard; Pin Count: 2; Value: 120k; Status: Preferred; Manufacturer Part Number: R1206_120K_1%_0.25W_100PPM; Case: 1206; Mounted: Yes; Sense: No; Socket: No; SMD: Yes; Manufacturer1 Example: NIC COMPONENT; Manufacturer1 ComponentHeight: 0.65mm; HelpURL: \\cern.ch\dfs\Applications\Altium\Datasheets\R1206_NIC_NRC.pdf; Author: CERN DEM JLC; CreateDate: 03.12.2007; LatestRevisionDate: 13.03.2008
R111 R114 R211 R214 = RMF_5R6_5%_3W_250PPM_2286-1670X520: Resistor - 5%; Part Description: Leaded Power Metal Film Resistor; Manufacturer: GENERIC; Manufacturer1 Part Number: PR03000205608JAC00; Power: 3W; TC: ±250ppm/°C; PressFit: No; Part Number: RMF_5R6_5%_3W_250PPM_2286-1670X520; Component Kind: Standard; Component Type: Standard; Pin Count: 2; Value: 5R6; Status: Preferred; Tolerance: ±5%; Manufacturer Part Number: RMF_5R6_5%_3W_250PPM_2286-1670X520; Case: LS22.86 L16.7 x D5.2; Mounted: Yes; Sense: No; Socket: No; SMD: No; ComponentHeight: 5.2mm; Manufacturer1 Example: VISHAY BCCOMPONENT; Manufacturer1 ComponentHeight: 5.2mm; HelpURL: \\cern.ch\dfs\Applications\Altium\Datasheets\RMF_VISHAY_PR03.pdf; Author: CERN DEM JLC; CreateDate: 19.06.2008; LatestRevisionDate: 01.10.2012
R112 R212 = R1206_10K_1%_0.25W_100PPM: Resistor - 1%; Part Description: General Purpose Thick Film Chip Resistor; Manufacturer: GENERIC; Manufacturer1 Part Number: NRC12F1002TRF; Power: 0.25W; TC: ±100ppm/°C; PressFit: No; Part Number: R1206_10K_1%_0.25W_100PPM; Component Kind: Standard; Component Type: Standard; Pin Count: 2; Value: 10k; Status: Preferred; Manufacturer Part Number: R1206_10K_1%_0.25W_100PPM; Case: 1206; Mounted: Yes; Sense: No; Socket: No; SMD: Yes; Manufacturer1 Example: NIC COMPONENT; Manufacturer1 ComponentHeight: 0.65mm; HelpURL: \\cern.ch\dfs\Applications\Altium\Datasheets\R1206_NIC_NRC.pdf; Author: CERN DEM JLC; CreateDate: 03.12.2007; LatestRevisionDate: 13.03.2008
R113 R213 = R1206_6K8_1%_0.25W_100PPM: Resistor - 1%; Part Description: General Purpose Thick Film Chip Resistor; Manufacturer: GENERIC; Manufacturer1 Part Number: NRC12F6801TRF; Power: 0.25W; TC: ±100ppm/°C; PressFit: No; Part Number: R1206_6K8_1%_0.25W_100PPM; Component Kind: Standard; Component Type: Standard; Pin Count: 2; Value: 6k8; Status: Preferred; Manufacturer Part Number: R1206_6K8_1%_0.25W_100PPM; Case: 1206; Mounted: Yes; Sense: No; Socket: No; SMD: Yes; Manufacturer1 Example: NIC COMPONENT; Manufacturer1 ComponentHeight: 0.65mm; HelpURL: \\cern.ch\dfs\Applications\Altium\Datasheets\R1206_NIC_NRC.pdf; Author: CERN DEM JLC; CreateDate: 03.12.2007; LatestRevisionDate: 13.03.2008
T1 = BC817: NPN Transistor; Part Description: 45V 500mA NPN General-Purpose Transistor; Manufacturer: NXP SEMICONDUCTORS; PressFit: No; Bonding: No; Part Number: BC817; Component Kind: Standard; Component Type: Standard; Device: BC817; PackageDescription: SOT23, 0.95mm Pitch; 3 Pin, 1.30mm W X 2.90mm L X 1.10mm H body, IPC Medium Density; Manufacturer Part Number: BC817; Pin Count: 3; Case: SOT23-3; Mounted: Yes; Socket: No; SMD: Yes; Sense: No; ComponentHeight: 1.1mm; HelpURL: \\cern.ch\dfs\Applications\Altium\Datasheets\BC817.pdf; Author: CERN DEM JLC; CreateDate: 12.05.2011; LatestRevisionDate: 12.05.2011
TP1-TP19 TP101-TP107 TP201-TP207 = Test point: Published: 8-Jun-2000; LatestRevisionDate: 17-Jul-2002; LatestRevisionNote: Re-released for DXP Platform.; PackageReference: AXIAL-0.3; Publisher: Altium Limited